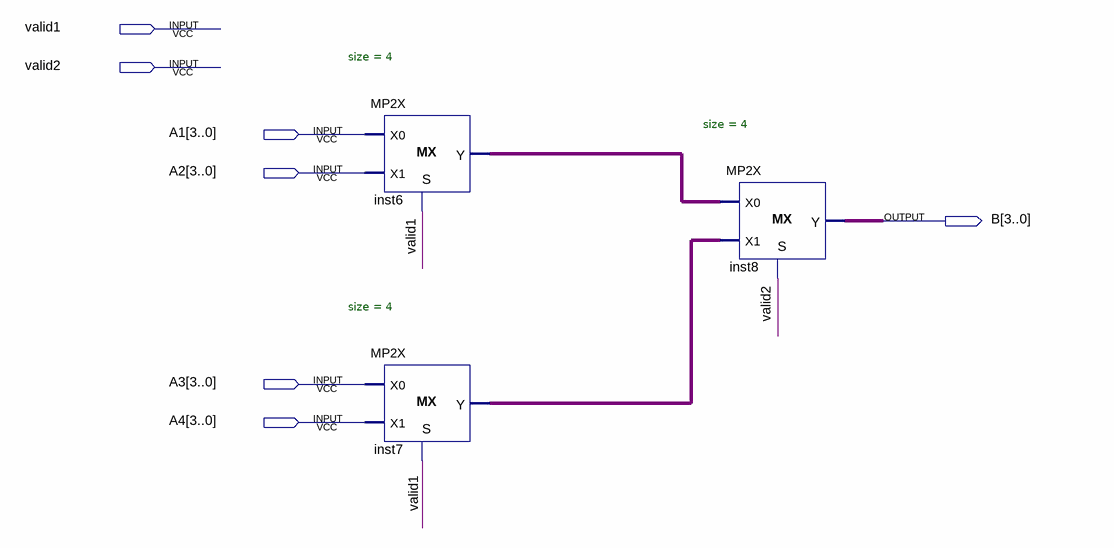
[diagram p0: schematic sheet]
// Quartus schematic MP4.bdf as structural Verilog: 3 symbols, 7 pins
module MP4 (
  input  valid1,
  input  valid2,
  input  [3:0] A1,
  input  [3:0] A2,
  input  [3:0] A3,
  input  [3:0] A4,
  output [3:0] B
);

  wire [3:0] inst6_y, inst7_y;

  MP2X #(.size(4)) inst6 (.S(valid1), .X0(A1), .X1(A2), .Y(inst6_y));
  MP2X #(.size(4)) inst7 (.S(valid1), .X0(A3), .X1(A4), .Y(inst7_y));
  MP2X #(.size(4)) inst8 (.S(valid2), .X0(inst6_y), .X1(inst7_y), .Y(B));
endmodule
